# EAGLE design simCon (EAGLE 7.6.0)
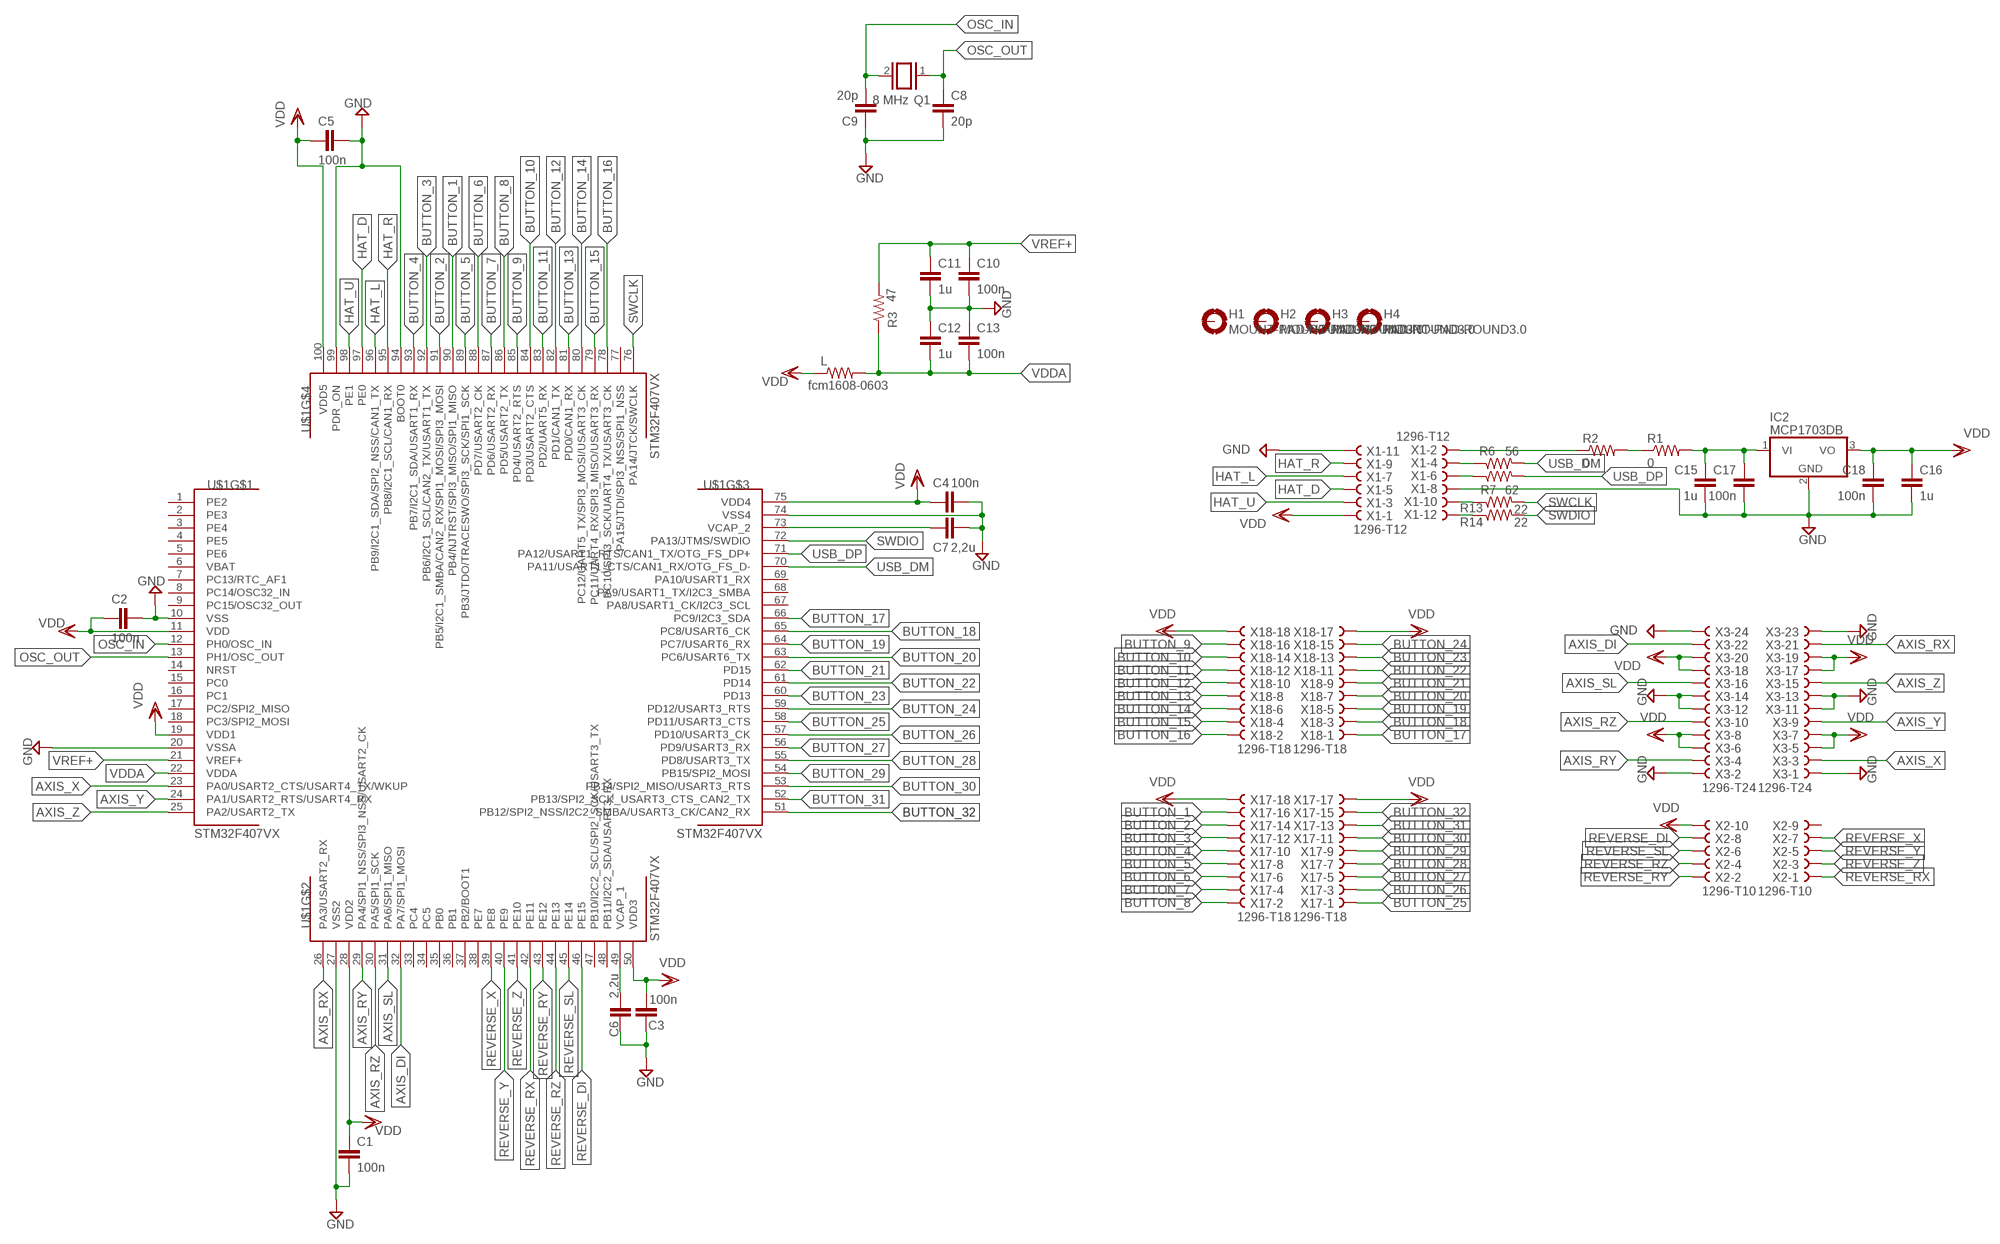
[diagram p0: schematic, sheet 1]

## Parts
C1  100n  C-EUC0805K  [C0805K]
C2  100n  C-EUC0805K  [C0805K]
C3  100n  C-EUC0805K  [C0805K]
C4  100n  C-EUC0805K  [C0805K]
C5  100n  C-EUC0805K  [C0805K]
C6  2,2u  C-EUC0805K  [C0805K]
C7  2,2u  C-EUC0805K  [C0805K]
C8  20p  C-EUC0805K  [C0805K]
C9  20p  C-EUC0805K  [C0805K]
C10  100n  C-EUC0805K  [C0805K]
C11  1u  C-EUC0805K  [C0805K]
C12  1u  C-EUC0805K  [C0805K]
C13  100n  C-EUC0805K  [C0805K]
C15  1u  C-EUC0805K  [C0805K]
C16  1u  C-EUC0805K  [C0805K]
C17  100n  C-EUC0805K  [C0805K]
C18  100n  C-EUC0805K  [C0805K]
H1  MOUNT-PAD-ROUND3.0  [3,0-PAD]
H2  MOUNT-PAD-ROUND3.0  [3,0-PAD]
H3  MOUNT-PAD-ROUND3.0  [3,0-PAD]
H4  MOUNT-PAD-ROUND3.0  [3,0-PAD]
IC2  MCP1703DB  [SOT223]
L  fcm1608-0603  R-US_M0805  [M0805]
Q1  8 MHz  XTAL/S  [QS]
R1  0  R-US_R1206  [R1206]
R2  0  R-US_R1206  [R1206]
R3  47  R-US_M0805  [M0805]
R6  56  R-US_M0805  [M0805]
R7  62  R-US_M0805  [M0805]
R13  22  R-US_M0805  [M0805]
R14  22  R-US_M0805  [M0805]
U$1  STM32F407VX  [LQFP100]
X1  1296-T12  [1296-12]
X2  1296-T10  [1296-10]
X3  1296-T24  [1296-24]
X17  1296-T18  [1296-18]
X18  1296-T18  [1296-18]

## Nets
AXIS_DI: U$1.32(PA7/SPI1_MOSI) X3.22
AXIS_RX: U$1.26(PA3/USART2_RX) X3.21
AXIS_RY: U$1.29(PA4/SPI1_NSS/SPI3_NSS/USART2_CK) X3.4
AXIS_RZ: U$1.30(PA5/SPI1_SCK) X3.10
AXIS_SL: U$1.31(PA6/SPI1_MISO) X3.16
AXIS_X: U$1.23(PA0/USART2_CTS/USART4_TX/WKUP) X3.3
AXIS_Y: U$1.24(PA1/USART2_RTS/USART4_RX) X3.9
AXIS_Z: U$1.25(PA2/USART2_TX) X3.15
BUTTON_1: U$1.90(PB4/NJTRST/SPI3_MISO/SPI1_MISO) X17.16
BUTTON_2: U$1.91(PB5/I2C1_SMBA/CAN2_RX/SPI1_MOSI/SPI3_MOSI) X17.14
BUTTON_3: U$1.92(PB6/I2C1_SCL/CAN2_TX/USART1_TX) X17.12
BUTTON_4: U$1.93(PB7/I2C1_SDA/USART1_RX) X17.10
BUTTON_5: U$1.89(PB3/JTDO/TRACESWO/SPI3_SCK/SPI1_SCK) X17.8
BUTTON_6: U$1.88(PD7/USART2_CK) X17.6
BUTTON_7: U$1.87(PD6/USART2_RX) X17.4
BUTTON_8: U$1.86(PD5/USART2_TX) X17.2
BUTTON_9: U$1.85(PD4/USART2_RTS) X18.16
BUTTON_10: U$1.84(PD3/USART2_CTS) X18.14
BUTTON_11: U$1.83(PD2/UART5_RX) X18.12
BUTTON_12: U$1.82(PD1/CAN1_TX) X18.10
BUTTON_13: U$1.81(PD0/CAN1_RX) X18.8
BUTTON_14: U$1.80(PC12/UART5_TX/SPI3_MOSI/USART3_CK) X18.6
BUTTON_15: U$1.79(PC11/UART4_RX/SPI3_MISO/USART3_RX) X18.4
BUTTON_16: U$1.78(PC10/SPI3_SCK/UART4_TX/USART3_CK) X18.2
BUTTON_17: U$1.66(PC9/I2C3_SDA) X18.1
BUTTON_18: U$1.65(PC8/USART6_CK) X18.3
BUTTON_19: U$1.64(PC7/USART6_RX) X18.5
BUTTON_20: U$1.63(PC6/USART6_TX) X18.7
BUTTON_21: U$1.62(PD15) X18.9
BUTTON_22: U$1.61(PD14) X18.11
BUTTON_23: U$1.60(PD13) X18.13
BUTTON_24: U$1.59(PD12/USART3_RTS) X18.15
BUTTON_25: U$1.58(PD11/USART3_CTS) X17.1
BUTTON_26: U$1.57(PD10/USART3_CK) X17.3
BUTTON_27: U$1.56(PD9/USART3_RX) X17.5
BUTTON_28: U$1.55(PD8/USART3_TX) X17.7
BUTTON_29: U$1.54(PB15/SPI2_MOSI) X17.9
BUTTON_30: U$1.53(PB14/SPI2_MISO/USART3_RTS) X17.11
BUTTON_31: U$1.52(PB13/SPI2_SCK_USART3_CTS_CAN2_TX) X17.13
BUTTON_32: U$1.51(PB12/SPI2_NSS/I2C2_SMBA/USART3_CK/CAN2_RX) X17.15
GND: C1.2 C2.1 C3.1 C4.1 C5.1 C6.1 C7.1 C8.2 C9.1 C10.2 C11.2 C12.1 C13.1 C15.2 C16.2 C17.2 C18.2 IC2.2(GND) U$1.10(VSS) U$1.20(VSSA) U$1.27(VSS2) U$1.74(VSS4) U$1.94(BOOT0) U$1.99(PDR_ON) X1.8 X1.11 X3.1 X3.2 X3.11 X3.12 X3.13 X3.14 X3.23 X3.24
HAT_D: U$1.97(PE0) X1.5
HAT_L: U$1.96(PB9/I2C1_SDA/SPI2_NSS/CAN1_TX) X1.7
HAT_R: U$1.95(PB8/I2C1_SCL/CAN1_RX) X1.9
HAT_U: U$1.98(PE1) X1.3
N$1: C7.2 U$1.73(VCAP_2)
N$2: C6.2 U$1.49(VCAP_1)
N$3: R6.1 X1.4
N$5: R7.1 X1.6
N$6: R14.1 X1.12
N$7: R13.1 X1.10
N$8: R2.1 X1.2
N$9: R1.1 R2.2
N$10: C15.1 C17.1 IC2.1(VI) R1.2
OSC_IN: C9.2 Q1.2 U$1.12(PH0/OSC_IN)
OSC_OUT: C8.1 Q1.1 U$1.13(PH1/OSC_OUT)
REVERSE_DI: U$1.46(PE15) X2.8
REVERSE_RX: U$1.42(PE11) X2.1
REVERSE_RY: U$1.43(PE12) X2.2
REVERSE_RZ: U$1.44(PE13) X2.4
REVERSE_SL: U$1.45(PE14) X2.6
REVERSE_X: U$1.39(PE8) X2.7
REVERSE_Y: U$1.40(PE9) X2.5
REVERSE_Z: U$1.41(PE10) X2.3
SWCLK: R13.2 U$1.76(PA14/JTCK/SWCLK)
SWDIO: R14.2 U$1.72(PA13/JTMS/SWDIO)
USB_DM: R6.2 U$1.70(PA11/USART1_CTS/CAN1_RX/OTG_FS_D-)
USB_DP: R7.2 U$1.71(PA12/USART1_RTS/CAN1_TX/OTG_FS_DP+)
VDD: C1.1 C2.2 C3.2 C4.2 C5.2 C16.1 C18.1 IC2.3(VO) L.1 U$1.11(VDD) U$1.19(VDD1) U$1.28(VDD2) U$1.50(VDD3) U$1.75(VDD4) U$1.100(VDD5) X1.1 X2.10 X3.5 X3.6 X3.7 X3.8 X3.17 X3.18 X3.19 X3.20 X17.17 X17.18 X18.17 X18.18
VDDA: C12.2 C13.2 L.2 R3.1 U$1.22(VDDA)
VREF+: C10.1 C11.1 R3.2 U$1.21(VREF+)
Unconnected: H1.B3,0(MOUNT) H2.B3,0(MOUNT) H3.B3,0(MOUNT) H4.B3,0(MOUNT) U$1.1(PE2) U$1.2(PE3) U$1.3(PE4) U$1.4(PE5) U$1.5(PE6) U$1.6(VBAT) U$1.7(PC13/RTC_AF1) U$1.8(PC14/OSC32_IN) U$1.9(PC15/OSC32_OUT) U$1.14(NRST) U$1.15(PC0) U$1.16(PC1) U$1.17(PC2/SPI2_MISO) U$1.18(PC3/SPI2_MOSI) U$1.33(PC4) U$1.34(PC5) U$1.35(PB0) U$1.36(PB1) U$1.37(PB2/BOOT1) U$1.38(PE7) U$1.47(PB10/I2C2_SCL/SPI2_SCK/USART3_TX) U$1.48(PB11/I2C2_SDA/USART3_RX) U$1.67(PA8/USART1_CK/I2C3_SCL) U$1.68(PA9/USART1_TX/I2C3_SMBA) U$1.69(PA10/USART1_RX) U$1.77(PA15/JTDI/SPI3_NSS/SPI1_NSS) X2.9

## Library data of the parts
C1-C13 C15-C18 = resistor:C-EU: CAPACITOR, European symbol
H1-H4 = holes:MOUNT-PAD-ROUND: MOUNTING PAD, round
IC2 = linear:MCP1703: 250 mA, 16V, Low Quiescent Current LDO Regulator Source: http://ww1.microchip.com/downloads/en/DeviceDoc/22049b.pdf
L R3 R6 R7 R13 R14 = adafruit:R-US_: RESISTOR, American symbol
Q1 = special:XTAL/S: CRYSTAL
R1 R2 = resistor:R-US_: RESISTOR, American symbol
U$1 = STM32F407Vx_LQFP100:STM32F407VX: STmicroelectronics Cortex M4 Series Typ: STM32F407Vx LQFP100 Copyright 2012 by Ersan Günes, Quantitec, info@quantitec.de
X1 = con-leotronics:1296-T12: 1.27mm SINGLE ROW FEMALE SOCKET Source: http://www.leotronics.co.uk/Conexcon/Data%20Sheets/sec.%20A/1296ing.pdf; OC_FARNELL: unknown; OC_NEWARK: unknown
X2 = con-leotronics:1296-T10: 1.27mm SINGLE ROW FEMALE SOCKET Source: http://www.leotronics.co.uk/Conexcon/Data%20Sheets/sec.%20A/1296ing.pdf; OC_FARNELL: unknown; OC_NEWARK: unknown
X3 = con-leotronics:1296-T24: 1.27mm SINGLE ROW FEMALE SOCKET Source: http://www.leotronics.co.uk/Conexcon/Data%20Sheets/sec.%20A/1296ing.pdf; OC_FARNELL: unknown; OC_NEWARK: unknown
X17 X18 = con-leotronics:1296-T18: 1.27mm SINGLE ROW FEMALE SOCKET Source: http://www.leotronics.co.uk/Conexcon/Data%20Sheets/sec.%20A/1296ing.pdf; OC_FARNELL: unknown; OC_NEWARK: unknown

## Net classes
0 default: clearance 0.205 mm

## Board
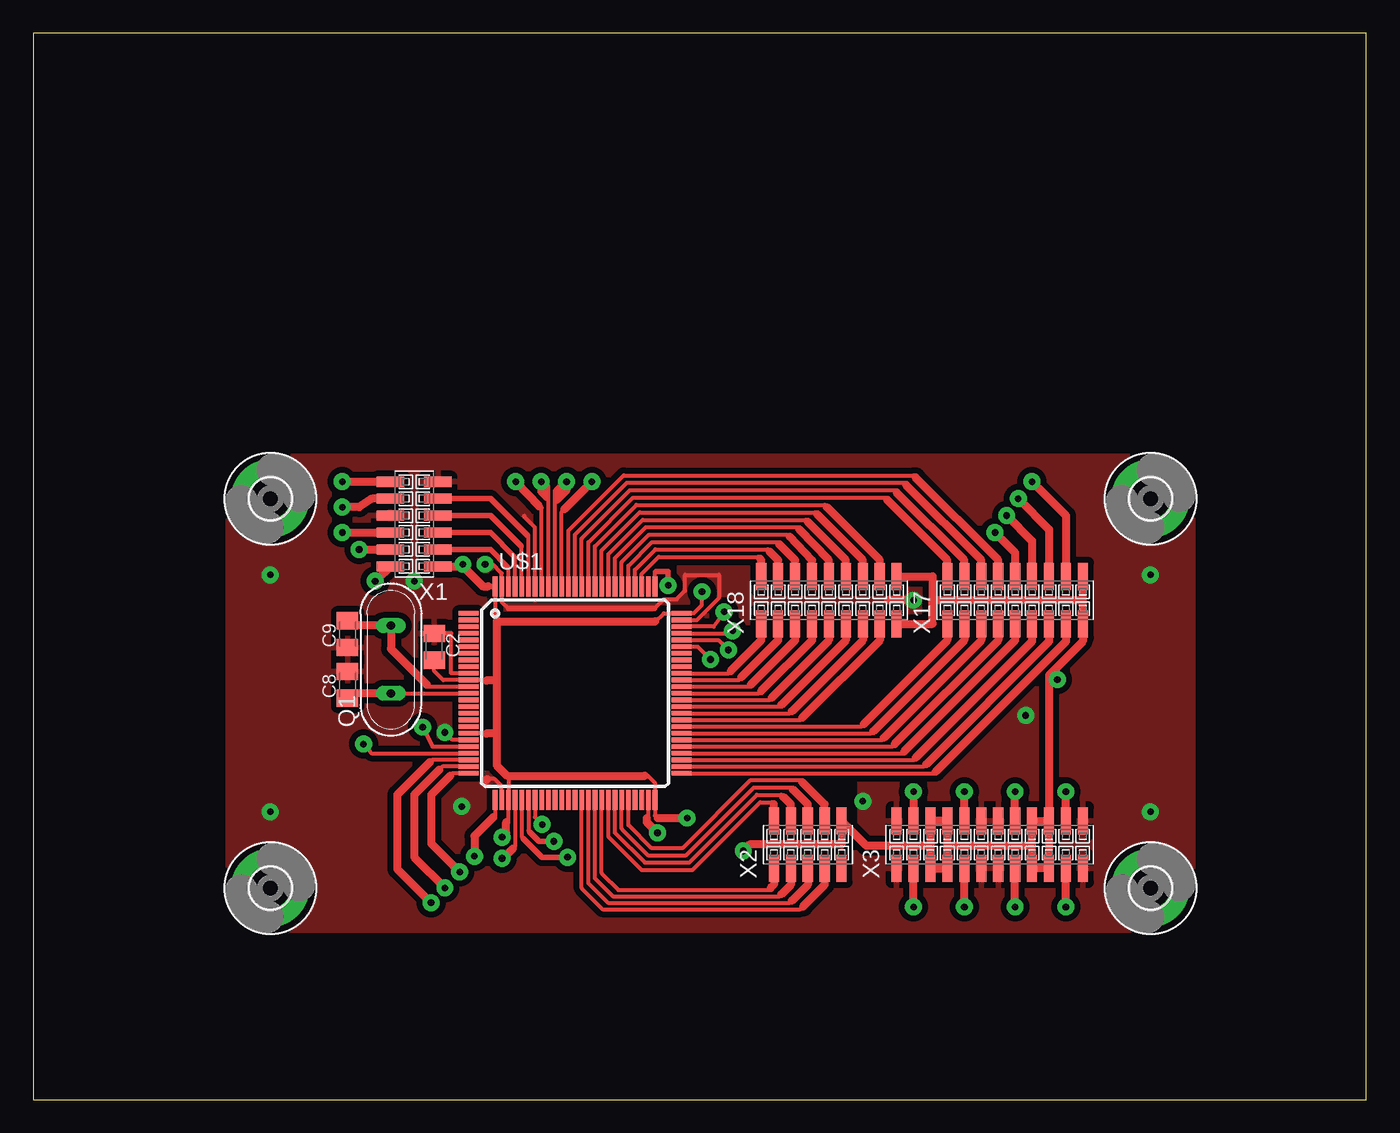
[diagram p1: board, top side]
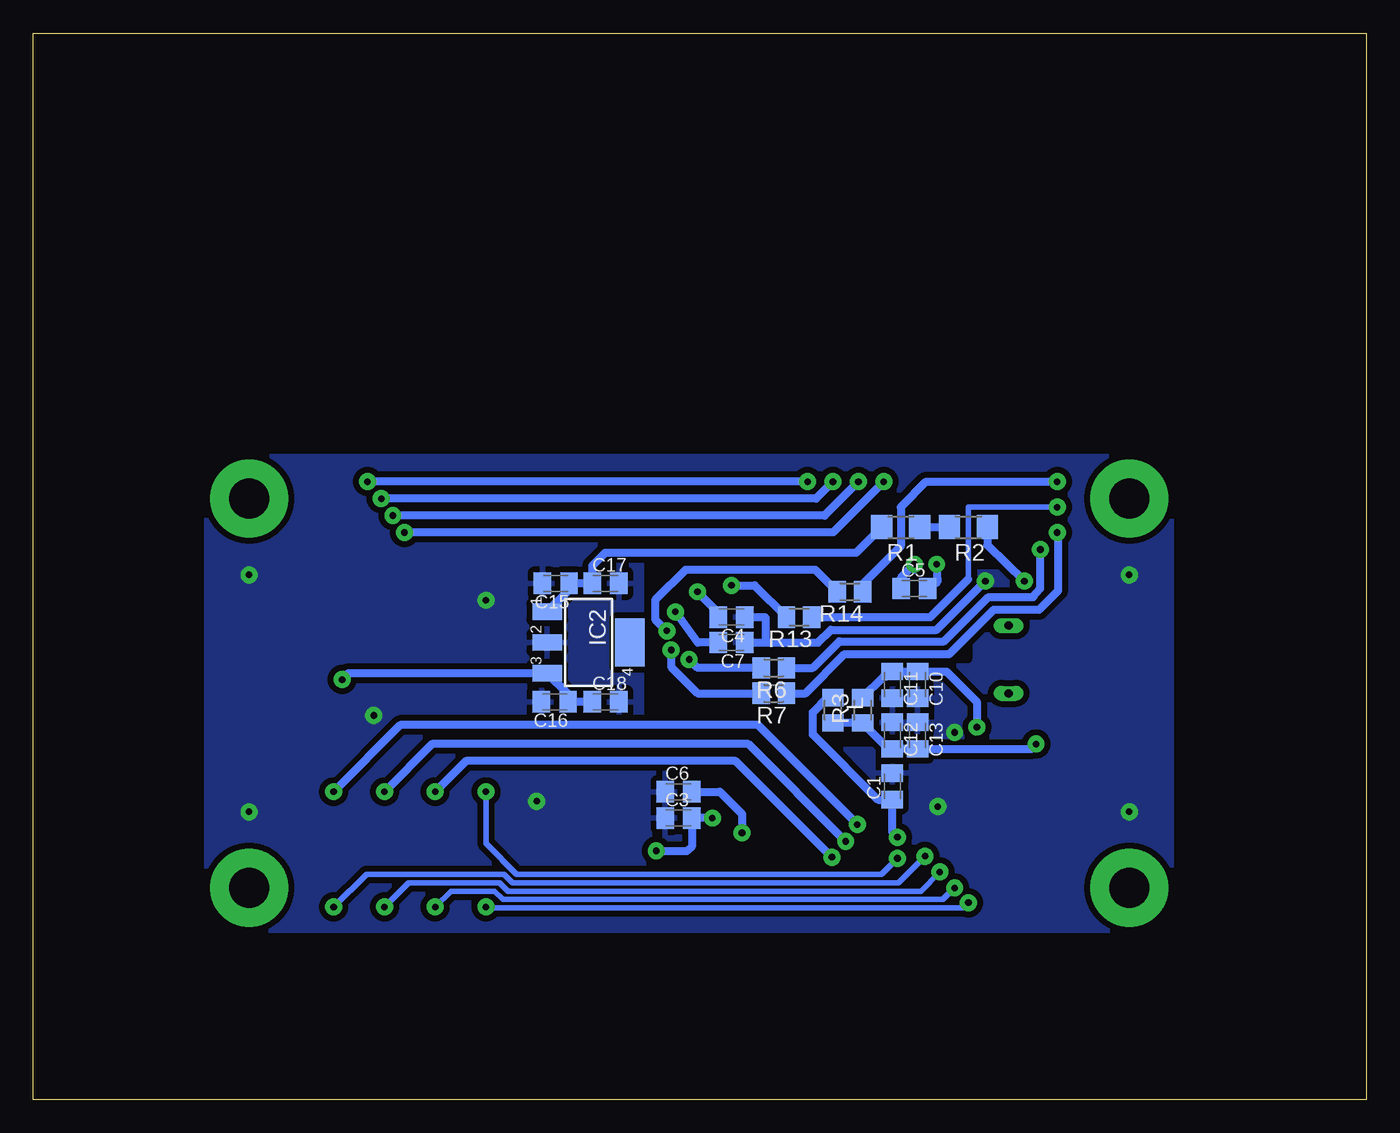
[diagram p2: board, bottom side, seen from below]

Size 100 x 80 mm. Coordinates in mm from the lower left corner, seen from the top.
Outline: 0,0 100,0 100,80 0,80 0,0
Copper layers (1*16): Top 0.035mm / dielectric 1.5mm / Bottom 0.035mm
Design rules "default *": minimum track width 10mil, minimum drill 24mil, track to track 0.45mm, track to pad 0.45mm, pad to pad 0.45mm, via to via 0.45mm, smd to smd 0.45mm, copper to edge 40mil, drill to drill 8mil, minimum pad ring 10mil, minimum via ring 8mil, stop-mask expansion 4mil, vias tented up to drill 0mil, thermal gap 0.45mm
tRestrict: area 58.4,20.7 to 61.6,24.1
bRestrict: area 29.8,36.8 to 38.7,42.5; area 29.8,33 to 44.5,36.8; area 44.5,33 to 47,36.8; area 45.7,28.9 to 54,40.2; area 27.3,40 to 29.2,41.9; area 36.2,25.4 to 40.6,27.3

### Footprints (pad centres in the part's own frame; a part is rotated, then mirrored left to right if it is on the bottom)
C0805K = smd 1.3 x 1.6: 1 -1,0; 2 1,0
3,0-PAD = drill 3 pad 5.842: B3,0 0,0
SOT223 = smd 1.219 x 2.235: 1 -2.311,-3.099; 2 0,-3.099; 3 2.311,-3.099 | smd 3.6 x 2.2: 4 0,3.099
M0805 = smd 1.3 x 1.6: 1 -0.95,0; 2 0.95,0
QS = drill 0.61 long: 1 -2.54,0; 2 2.54,0
R1206 = smd 1.6 x 1.803: 1 -1.422,0; 2 1.422,0
LQFP100 = smd 1.5 x 0.35: 1 -8,6; 2 -8,5.5; 3 -8,5; 4 -8,4.5; 5 -8,4; 6 -8,3.5; 7 -8,3; 8 -8,2.5; 9 -8,2; 10 -8,1.5; 11 -8,1; 12 -8,0.5; 13 -8,0; 14 -8,-0.5; 15 -8,-1; 16 -8,-1.5; 17 -8,-2; 18 -8,-2.5; 19 -8,-3; 20 -8,-3.5; 21 -8,-4; 22 -8,-4.5; 23 -8,-5; 24 -8,-5.5; 25 -8,-6; 51 8,-6; 52 8,-5.5; 53 8,-5; 54 8,-4.5; 55 8,-4; 56 8,-3.5; 57 8,-3; 58 8,-2.5; 59 8,-2; 60 8,-1.5; 61 8,-1; 62 8,-0.5; 63 8,0; 64 8,0.5; 65 8,1; 66 8,1.5; 67 8,2; 68 8,2.5; 69 8,3; 70 8,3.5; 71 8,4; 72 8,4.5; 73 8,5; 74 8,5.5; 75 8,6 | smd 0.35 x 1.5: 26 -6,-8; 27 -5.5,-8; 28 -5,-8; 29 -4.5,-8; 30 -4,-8; 31 -3.5,-8; 32 -3,-8; 33 -2.5,-8; 34 -2,-8; 35 -1.5,-8; 36 -1,-8; 37 -0.5,-8; 38 0,-8; 39 0.5,-8; 40 1,-8; 41 1.5,-8; 42 2,-8; 43 2.5,-8; 44 3,-8; 45 3.5,-8; 46 4,-8; 47 4.5,-8; 48 5,-8; 49 5.5,-8; 50 6,-8; 76 6,8; 77 5.5,8; 78 5,8; 79 4.5,8; 80 4,8; 81 3.5,8; 82 3,8; 83 2.5,8; 84 2,8; 85 1.5,8; 86 1,8; 87 0.5,8; 88 0,8; 89 -0.5,8; 90 -1,8; 91 -1.5,8; 92 -2,8; 93 -2.5,8; 94 -3,8; 95 -3.5,8; 96 -4,8; 97 -4.5,8; 98 -5,8; 99 -5.5,8; 100 -6,8
1296-12 = smd 0.76 x 2.05: 1 -3.175,-1.78; 2 -3.175,1.78; 3 -1.905,-1.78; 4 -1.905,1.78; 5 -0.635,-1.78; 6 -0.635,1.78; 7 0.635,-1.78; 8 0.635,1.78; 9 1.905,-1.78; 10 1.905,1.78; 11 3.175,-1.78; 12 3.175,1.78
1296-10 = smd 0.76 x 2.05: 1 -2.54,-1.78; 2 -2.54,1.78; 3 -1.27,-1.78; 4 -1.27,1.78; 5 0,-1.78; 6 0,1.78; 7 1.27,-1.78; 8 1.27,1.78; 9 2.54,-1.78; 10 2.54,1.78
1296-24 = smd 0.76 x 2.05: 1 -6.985,-1.78; 2 -6.985,1.78; 3 -5.715,-1.78; 4 -5.715,1.78; 5 -4.445,-1.78; 6 -4.445,1.78; 7 -3.175,-1.78; 8 -3.175,1.78; 9 -1.905,-1.78; 10 -1.905,1.78; 11 -0.635,-1.78; 12 -0.635,1.78; 13 0.635,-1.78; 14 0.635,1.78; 15 1.905,-1.78; 16 1.905,1.78; 17 3.175,-1.78; 18 3.175,1.78; 19 4.445,-1.78; 20 4.445,1.78; 21 5.715,-1.78; 22 5.715,1.78; 23 6.985,-1.78; 24 6.985,1.78
1296-18 = smd 0.76 x 2.05: 1 -5.08,-1.78; 2 -5.08,1.78; 3 -3.81,-1.78; 4 -3.81,1.78; 5 -2.54,-1.78; 6 -2.54,1.78; 7 -1.27,-1.78; 8 -1.27,1.78; 9 0,-1.78; 10 0,1.78; 11 1.27,-1.78; 12 1.27,1.78; 13 2.54,-1.78; 14 2.54,1.78; 15 3.81,-1.78; 16 3.81,1.78; 17 5.08,-1.78; 18 5.08,1.78

### Placement (x,y rotation side)
C1  35.56,23.5 90 bottom
C2  30.08,33.97 270 top
C3  51.59,21.11 0 bottom
C4  47.62,36.2 180 bottom
C5  33.89,38.34 0 bottom
C6  51.59,23.1 0 bottom
C7  47.62,34.29 180 bottom
C8  23.57,31.11 90 top
C9  23.57,34.92 90 top
C10  33.66,31.11 270 bottom
C11  35.56,31.11 270 bottom
C12  35.56,27.3 270 bottom
C13  33.66,27.3 270 bottom
C15  60.8,38.73 180 bottom
C16  60.88,29.84 180 bottom
C17  57.07,38.73 0 bottom
C18  57.07,29.84 0 bottom
H1  83.82,45.09 0 top
H2  83.82,15.88 0 top
H3  17.78,15.88 0 top
H4  17.78,45.09 0 top
IC2  58.34,34.29 270 bottom
L  40.01,29.21 270 bottom
Q1  26.83,33.02 90 top
R1  34.92,42.94 180 bottom
R2  29.84,42.94 180 bottom
R3  37.78,29.21 90 bottom
R6  44.45,32.38 180 bottom
R7  44.45,30.48 180 bottom
R13  42.55,36.2 180 bottom
R14  38.73,38.1 180 bottom
U$1  40.64,30.48 0 top
X1  28.57,43.18 90 top
X2  58.1,19.13 0 top
X3  71.75,19.13 0 top
X17  73.66,37.47 0 top
X18  59.69,37.47 0 top

### Tracks (layer width: path | path; a pad name or v marks a point on that pad's centre or on a via)
AXIS_DI  (via drill 0.5 pad 1.27)
  Top 0.305: U$1.32 37.64,21.18 v38.18,20.64
  Top 0.61: X3.22 v77.47,23.1
  Bottom 0.61: v38.18,20.64 45.64,28.1 72.47,28.1 v77.47,23.1
AXIS_RX  (via drill 0.5 pad 1.27)
  Top 0.305: U$1.26 34.64,21.3 34.53,21.19
  Top 0.61: 34.53,21.19 33.1,19.76 v33.1,18.26 | v77.47,14.45 X3.21
  Bottom 0.406: v33.1,18.26 35.08,16.27 64.06,16.27 64.69,16.91 75.01,16.91 v77.47,14.45
AXIS_RY  (via drill 0.5 pad 1.27)
  Top 0.305: U$1.29 36.14,19 35.96,18.81
  Top 0.61: v66.04,23.1 X3.4 | v35.16,18.1 35.24,18.1 35.96,18.81
  Bottom 0.406: v35.16,18.1 36.35,16.91 63.74,16.91 66.04,19.21 v66.04,23.1
AXIS_RZ  (via drill 0.5 pad 1.27)
  Top 0.305: U$1.30 36.64,19.72 36.75,19.61
  Top 0.406: v40.08,18.18 38.18,18.18 36.75,19.61
  Top 0.61: X3.10 v69.85,23.1
  Bottom 0.61: v40.08,18.18 47.31,25.4 67.55,25.4 v69.85,23.1
AXIS_SL  (via drill 0.5 pad 1.27)
  Top 0.305: U$1.31 37.14,20.17 37.23,20.08
  Top 0.406: v39.05,19.37 37.94,19.37 37.23,20.08
  Top 0.61: X3.16 v73.66,23.1
  Bottom 0.61: v39.05,19.37 46.35,26.67 70.09,26.67 v73.66,23.1
AXIS_X  (via drill 0.5 pad 1.27)
  Top 0.305: U$1.23 29.93,25.48 29.77,25.32
  Top 0.61: 29.77,25.32 27.3,22.86 27.3,17.3 v29.84,14.76 | v66.04,14.45 X3.3
  Bottom 0.406: v29.84,14.76 30.24,14.37 65.96,14.37 v66.04,14.45
AXIS_Y  (via drill 0.5 pad 1.27)
  Top 0.305: U$1.24 30.7,24.98 30.48,24.77
  Top 0.61: 30.48,24.77 28.57,22.86 28.57,18.18 v30.88,15.88 | v69.85,14.45 X3.9
  Bottom 0.406: v30.88,15.88 31.75,15 64.77,15 65.41,15.64 68.66,15.64 v69.85,14.45
AXIS_Z  (via drill 0.5 pad 1.27)
  Top 0.305: U$1.25 31.46,24.48 31.27,24.29
  Top 0.61: 31.27,24.29 29.84,22.86 29.84,19.21 v31.99,17.07 | v73.66,14.45 X3.15
  Bottom 0.406: v31.99,17.07 33.42,15.64 64.37,15.64 65.01,16.27 71.83,16.27 v73.66,14.45
BUTTON_1  (via drill 0.5 pad 1.27)
  Top 0.305: U$1.90 39.64,44.09 39.85,44.29
  Top 0.61: v41.91,46.35 39.85,44.29 | v74.93,46.35 77.47,43.81 X17.16
  Bottom 0.61: v41.91,46.35 v74.93,46.35
BUTTON_2  (via drill 0.5 pad 1.27)
  Top 0.305: U$1.91 39.14,45.49 39.29,45.64
  Top 0.61: 39.29,45.64 v40.01,46.35 40.01,45.72 39.29,45.01 | v73.9,45.09 76.2,42.78 X17.14
  Bottom 0.61: v40.01,46.35 41.27,45.09 v73.9,45.09
BUTTON_3  (via drill 0.5 pad 1.27)
  Top 0.305: U$1.92 38.64,45.81 38.5,45.96
  Top 0.61: 38.5,45.96 v38.1,46.35 38.1,45.64 38.5,45.24 | v73.03,43.81 74.93,41.91 X17.12
  Bottom 0.61: v38.1,46.35 40.64,43.81 v73.03,43.81
BUTTON_4  (via drill 0.5 pad 1.27)
  Top 0.305: U$1.93 38.14,44.41 37.94,44.53
  Top 0.61: v36.2,46.35 37.94,44.53 | v72.15,42.55 73.66,41.04 X17.10
  Bottom 0.61: v36.2,46.35 40.01,42.55 v72.15,42.55
BUTTON_5
  Top 0.305: U$1.89 40.14,42.68 44.29,46.83 66.04,46.83 66.2,46.67
  Top 0.61: X17.8 72.39,40.48 66.2,46.67
BUTTON_6
  Top 0.305: U$1.88 40.64,42.39 44.53,46.28 65.33,46.28 65.48,46.12
  Top 0.61: X17.6 71.12,40.48 65.48,46.12
BUTTON_7
  Top 0.305: U$1.87 41.14,42.09 44.77,45.72 64.61,45.72 64.77,45.56
  Top 0.61: X17.4 69.85,40.48 64.77,45.56
BUTTON_8
  Top 0.305: U$1.86 41.64,41.8 45.01,45.16 63.9,45.16 64.06,45.01
  Top 0.61: X17.2 68.58,40.48 64.06,45.01
BUTTON_9
  Top 0.305: U$1.85 42.14,41.51 45.24,44.61 59.37,44.61 59.53,44.45
  Top 0.61: X18.16 63.5,40.48 59.53,44.45
BUTTON_10
  Top 0.305: U$1.84 42.64,41.21 45.48,44.05 58.66,44.05 58.82,43.89
  Top 0.61: X18.14 62.23,40.48 58.82,43.89
BUTTON_11
  Top 0.305: U$1.83 43.14,40.92 45.72,43.5 57.94,43.5 58.1,43.34
  Top 0.61: X18.12 60.96,40.48 58.1,43.34
BUTTON_12
  Top 0.305: U$1.82 43.64,40.62 45.96,42.94 57.31,42.94 57.47,42.78
  Top 0.61: X18.10 59.69,40.48 57.47,42.78
BUTTON_13
  Top 0.305: U$1.81 44.14,40.33 46.2,42.39 56.52,42.39 56.75,42.23
  Top 0.61: X18.8 58.42,40.48 56.75,42.23
BUTTON_14
  Top 0.305: U$1.80 44.64,40.04 46.43,41.83 55.8,41.83 55.96,41.67
  Top 0.61: X18.6 57.15,40.48 55.96,41.67
BUTTON_15
  Top 0.305: U$1.79 45.14,39.74 46.67,41.27 55.09,41.27 55.24,41.12
  Top 0.61: X18.4 55.88,40.48 55.24,41.12
BUTTON_16
  Top 0.305: U$1.78 45.64,39.45 46.91,40.72 54.37,40.72 54.53,40.56
  Top 0.61: 54.53,40.56 54.61,40.48 X18.2
BUTTON_17
  Top 0.305: U$1.66 52.14,31.98 52.31,32.15
  Top 0.61: X18.1 54.61,34.45 52.31,32.15
BUTTON_18
  Top 0.305: U$1.65 52.91,31.48 53.1,31.67
  Top 0.61: X18.3 55.88,34.45 53.1,31.67
BUTTON_19
  Top 0.305: U$1.64 53.68,30.98 53.82,31.11
  Top 0.61: X18.5 57.15,34.45 53.82,31.11
BUTTON_20
  Top 0.305: U$1.63 54.45,30.48 54.61,30.64
  Top 0.61: X18.7 58.42,34.45 54.61,30.64
BUTTON_21
  Top 0.305: U$1.62 55.22,29.98 55.4,30.16
  Top 0.61: X18.9 59.69,34.45 55.4,30.16
BUTTON_22
  Top 0.305: U$1.61 55.99,29.48 56.12,29.61
  Top 0.61: X18.11 60.96,34.45 56.12,29.61
BUTTON_23
  Top 0.305: U$1.60 56.76,28.98 56.91,29.13
  Top 0.61: X18.13 62.23,34.45 56.91,29.13
BUTTON_24
  Top 0.305: U$1.59 57.53,28.48 57.71,28.65
  Top 0.61: X18.15 63.5,34.45 57.71,28.65
BUTTON_25
  Top 0.305: U$1.58 62.11,27.98 62.47,28.34
  Top 0.61: X17.1 68.58,34.45 62.47,28.34 62.31,28.18
BUTTON_26
  Top 0.305: U$1.57 62.88,27.48 63.02,27.62
  Top 0.61: X17.3 69.85,34.45 63.02,27.62
BUTTON_27
  Top 0.305: U$1.56 63.65,26.98 63.82,27.15
  Top 0.61: X17.5 71.12,34.45 63.82,27.15
BUTTON_28
  Top 0.305: U$1.55 64.42,26.48 64.61,26.67
  Top 0.61: X17.7 72.39,34.45 64.61,26.67
BUTTON_29
  Top 0.305: U$1.54 65.19,25.98 65.33,26.11
  Top 0.61: X17.9 73.66,34.45 65.33,26.11
BUTTON_30
  Top 0.305: U$1.53 66.04,25.48 66.2,25.64
  Top 0.61: X17.11 74.93,34.37 66.2,25.64
BUTTON_31
  Top 0.305: U$1.52 66.81,24.98 66.99,25.16
  Top 0.61: X17.13 76.2,34.37 66.99,25.16
BUTTON_32
  Top 0.305: U$1.51 67.58,24.48 67.71,24.61
  Top 0.61: X17.15 77.47,34.37 67.71,24.61
GND  (via drill 0.5 pad 1.27)
  Top 0.305: U$1.20 31.43,26.99 30.96,27.46 | U$1.27 35.14,23.52 34.61,24.05 34.05,24.05 | U$1.10 31.35,31.98 31.35,34.97 C2.1 | 35.64,36.83 35.14,37.33 U$1.99 35.14,39.47 34.45,40.16 v33.89,40.16 | 46.59,36.83 47.31,37.54 48.26,37.54 48.9,38.18 48.9,39.37 51.44,39.37 51.44,37.62 49.79,35.98 U$1.74 | U$1.94 37.64,42.93 36.83,43.74 36.83,43.81
  Top 0.406: 35.64,36.83 46.59,36.83
  Top 0.61: 34.05,24.05 33.89,23.89 | v66.04,37.47 64.14,37.47 | 30.96,27.46 v30.88,27.54
  Bottom 0.305: v33.89,40.16 33.89,39.61
  Bottom 0.61: C5.1 34.89,39.16 v33.89,40.16 | C7.1 45.09,34.29 | 45.09,34.29 41.12,34.29 40.16,35.24 32.23,35.24 v28.57,38.89 | C4.1 45.09,36.2 45.09,34.29
  other vias: 17.78,21.59 32.15,21.99 74.45,28.81 62.23,22.38 17.78,39.37 83.82,39.37 83.82,21.59
  pour Bottom: 87,12.7 14.61,12.7 14.61,48.26 87,48.26
  pour Top: 87,12.7 14.61,12.7 14.61,48.26 87,48.26
HAT_D
  Top 0.305: 36.04,40.8 36.14,40.7 U$1.97
  Top 0.406: 36.04,40.8 34.29,42.55 X1.5
HAT_L
  Top 0.305: U$1.96 36.64,41.47 36.59,41.51
  Top 0.406: 36.59,41.51 34.29,43.81 X1.7
HAT_R
  Top 0.305: U$1.95 37.14,42.23 37.07,42.31
  Top 0.406: 37.07,42.31 34.29,45.09 X1.9
HAT_U
  Top 0.305: 35.56,40.01 35.64,39.92 U$1.98
  Top 0.406: 35.56,40.01 34.29,41.27 X1.3
N$1  (via drill 0.5 pad 1.27)
  Top 0.305: v51.83,36.59 51.04,35.48 U$1.73
  Bottom 0.61: C7.2 50.16,34.29 v51.83,36.59
N$2  (via drill 0.5 pad 1.27)
  Top 0.305: 46.04,21.11 46.14,21.17 U$1.49
  Top 0.61: v46.83,20 46.04,20.8 46.04,21.11
  Bottom 0.61: C6.2 48.5,23.1 46.83,21.43 v46.83,20
N$3  (via drill 0.5 pad 1.27)
  Top 0.61: v24.45,41.27 X1.4
  Bottom 0.61: R6.1 41.51,32.38 39.53,34.37 31.67,34.37 28.34,37.7 25,37.7 24.45,38.34 v24.45,41.27
N$5  (via drill 0.5 pad 1.27)
  Top 0.61: v23.18,42.55 X1.6
  Bottom 0.61: R7.1 42.07,30.48 39.13,33.42 31.27,33.42 27.94,36.75 24.53,36.75 23.1,38.18 23.1,42.47 v23.18,42.55
N$6  (via drill 0.5 pad 1.27)
  Top 0.61: v23.18,46.35 X1.12
  Bottom 0.61: v23.18,46.35 33.02,46.35 34.92,44.45 34.92,41.51 37.78,38.66 R14.1
N$7  (via drill 0.5 pad 1.27)
  Top 0.61: X1.10 25.4,45.09 24.45,44.45 v23.18,44.45
  Bottom 0.406: 29.84,39.05 29.84,44.45 v23.18,44.45
  Bottom 0.61: R13.1 32.7,36.2 29.84,39.05
N$8  (via drill 0.5 pad 1.27)
  Top 0.61: v25.64,38.89 25.8,39.01 X1.2
  Bottom 0.61: R2.1 28.42,41.6 v25.64,38.89
N$9
  Bottom 0.61: R1.1 R2.2
N$10
  Bottom 0.61: 59.88,38.16 60.13,37.91 | 60.13,37.91 IC2.1 | R1.2 38.25,41.04 57.07,41.04 58.07,40.04 C17.1 C15.1 | 59.93,38.78 C15.1 | C15.1 60.13,37.91
OSC_IN
  Top 0.305: 29.53,31.11 29.66,30.98 U$1.12
  Top 0.61: C9.2 23.38,35.56 Q1.2 26.83,33.81 29.53,31.11
OSC_OUT
  Top 0.305: Q1.1 U$1.13
  Top 0.61: Q1.1 23.38,30.48 C8.1
REVERSE_DI
  Top 0.305: 57.71,23.81 57.55,23.97 53.82,23.97 48.74,18.89 46.35,18.89 44.64,20.61 U$1.46
  Top 0.61: X2.8 59.37,22.15 57.71,23.81
REVERSE_RX
  Top 0.305: 55.32,15.88 55.17,15.72 43.89,15.72 42.64,16.97 U$1.42
  Top 0.61: X2.1 55.56,16.11 55.32,15.88
REVERSE_RY
  Top 0.305: 55.56,22.15 55.4,22.3 54.53,22.3 49.45,17.22 45.64,17.22 43.14,19.73 U$1.43
  Top 0.61: X2.2 55.56,22.15
REVERSE_RZ
  Top 0.305: 56.28,22.7 56.12,22.86 54.29,22.86 49.21,17.78 45.88,17.78 43.64,20.02 U$1.44
  Top 0.61: X2.4 56.83,22.15 56.28,22.7
REVERSE_SL
  Top 0.305: 56.99,23.26 56.83,23.42 54.05,23.42 48.97,18.34 46.12,18.34 44.14,20.31 U$1.45
  Top 0.61: X2.6 58.1,22.15 56.99,23.26
REVERSE_X
  Top 0.305: 57.74,14.49 57.55,14.29 42.7,14.29 41.14,15.85 U$1.39
  Top 0.61: X2.7 59.37,16.11 57.74,14.49
REVERSE_Y
  Top 0.305: 56.91,14.92 56.75,14.76 43.1,14.76 41.64,16.22 U$1.40
  Top 0.61: X2.5 58.1,16.11 56.91,14.92
REVERSE_Z
  Top 0.305: 56.12,15.4 55.96,15.24 43.5,15.24 42.14,16.6 U$1.41
  Top 0.61: X2.3 56.83,16.11 56.12,15.4
SWCLK  (via drill 0.5 pad 1.27)
  Top 0.305: U$1.76 46.64,39.61 46.72,39.61
  Top 0.406: 46.72,39.61 47.62,39.61 v47.62,38.58
  Bottom 0.61: v47.62,38.58 45.88,38.58 R13.2
SWDIO  (via drill 0.5 pad 1.27)
  Top 0.305: U$1.72 52.28,34.98 v52.47,35.16
  Bottom 0.61: v52.47,35.16 53.34,36.04 53.34,37.47 51.04,39.77 41.35,39.77 R14.2
USB_DM  (via drill 0.5 pad 1.27)
  Top 0.305: U$1.70 49.84,33.98 v50.8,33.02
  Bottom 0.61: R6.2 50.16,32.38 v50.8,33.02
USB_DP  (via drill 0.5 pad 1.27)
  Top 0.305: U$1.71 51.4,34.48 v52.15,33.73
  Bottom 0.61: v52.15,33.73 52.15,32.46 50.16,30.48 R7.2
VDD  (via drill 0.5 pad 1.27)
  Top 0.305: 35.56,24.29 35.64,24.37 U$1.28 35.64,20.96 35.48,20.8 | 33.97,27.46 33.97,27.48 U$1.19 | 33.97,31.43 33.97,31.48 U$1.11 30.75,31.48 30.08,32.15 C2.2 | 46.67,35.88 47.31,36.48 U$1.75 49.53,36.48 50.16,37.12 v50.16,38.1 | 45.88,24.29 46.12,24.29 46.64,23.77 U$1.50 46.64,21.3 46.83,21.11 | U$1.100 34.64,35.88 34.92,35.88
  Top 0.406: 34.13,38.5 34.15,38.48 U$1.100
  Top 0.61: 34.77,31.43 34.77,35.88 34.92,35.88 46.67,35.88 | 34.77,31.43 34.77,27.46 | 34.77,27.46 34.77,25.08 35.56,24.29 45.88,24.29 | 34.77,27.46 33.97,27.46 | 34.77,31.43 33.97,31.43 | 46.83,21.11 v49.05,21.11 49.13,21.03 | X3.5 X3.7 68.58,19.05 | 68.58,19.05 X3.8 X3.6 67.31,19.05 | 67.31,19.05 67.31,17.14 | X3.19 X3.17 74.93,19.05 | 74.93,19.05 X3.18 X3.20 | X3.20 76.2,17.14 | 74.93,19.05 68.58,19.05 | 76.2,31.75 76.2,31.83 78.74,34.37 X17.17 78.74,37.47 | 76.2,31.75 X3.20 | v35.16,19.68 35.48,20 35.48,20.8 | 67.31,19.05 62.5,19.05 X2.10 60.64,19.13 53.74,19.13 v53.26,18.65 | v76.83,31.51 76.44,31.51 76.2,31.75 | 78.74,37.47 X17.18 | X18.18 67.47,39.24 67.47,37.47 | 67.47,37.47 78.74,37.47 | X18.17 67.47,35.69 67.47,37.47 | X1.1 32.23,40.01 | 32.23,40.01 v32.23,40.16 | 32.23,40.01 33.73,38.5 34.13,38.5
  Bottom 0.61: v32.23,40.16 32.18,38.85 C5.2 | v49.05,21.11 C3.2 50.56,21.08 50.56,19.05 50.96,18.65 v53.26,18.65 | C18.1 C16.1 59.88,30.42 IC2.3 76.37,31.98 v76.83,31.51 | L.1 40.4,30.16 41.51,29.05 41.51,27.38 36.62,22.5 C1.1 35.56,20.08 v35.16,19.68 | C4.2 48.62,36.56 v50.16,38.1
VDDA  (via drill 0.5 pad 1.27)
  Top 0.305: v24.77,26.67 25.38,25.98 U$1.22
  Bottom 0.61: L.2 R3.1 35.83,26.3 C12.2 C13.2 25.13,26.3 v24.77,26.67
VREF+  (via drill 0.5 pad 1.27)
  Top 0.305: v29.21,27.94 29.96,26.48 U$1.21
  Bottom 0.61: R3.2 36.2,31.75 35.92,31.75 C11.1 C10.1 31.48,32.12 29.21,29.84 v29.21,27.94